# Altium schematic sheet Sensors.SchDoc
size A4; SheetNumber: 5; SheetTotal: 7
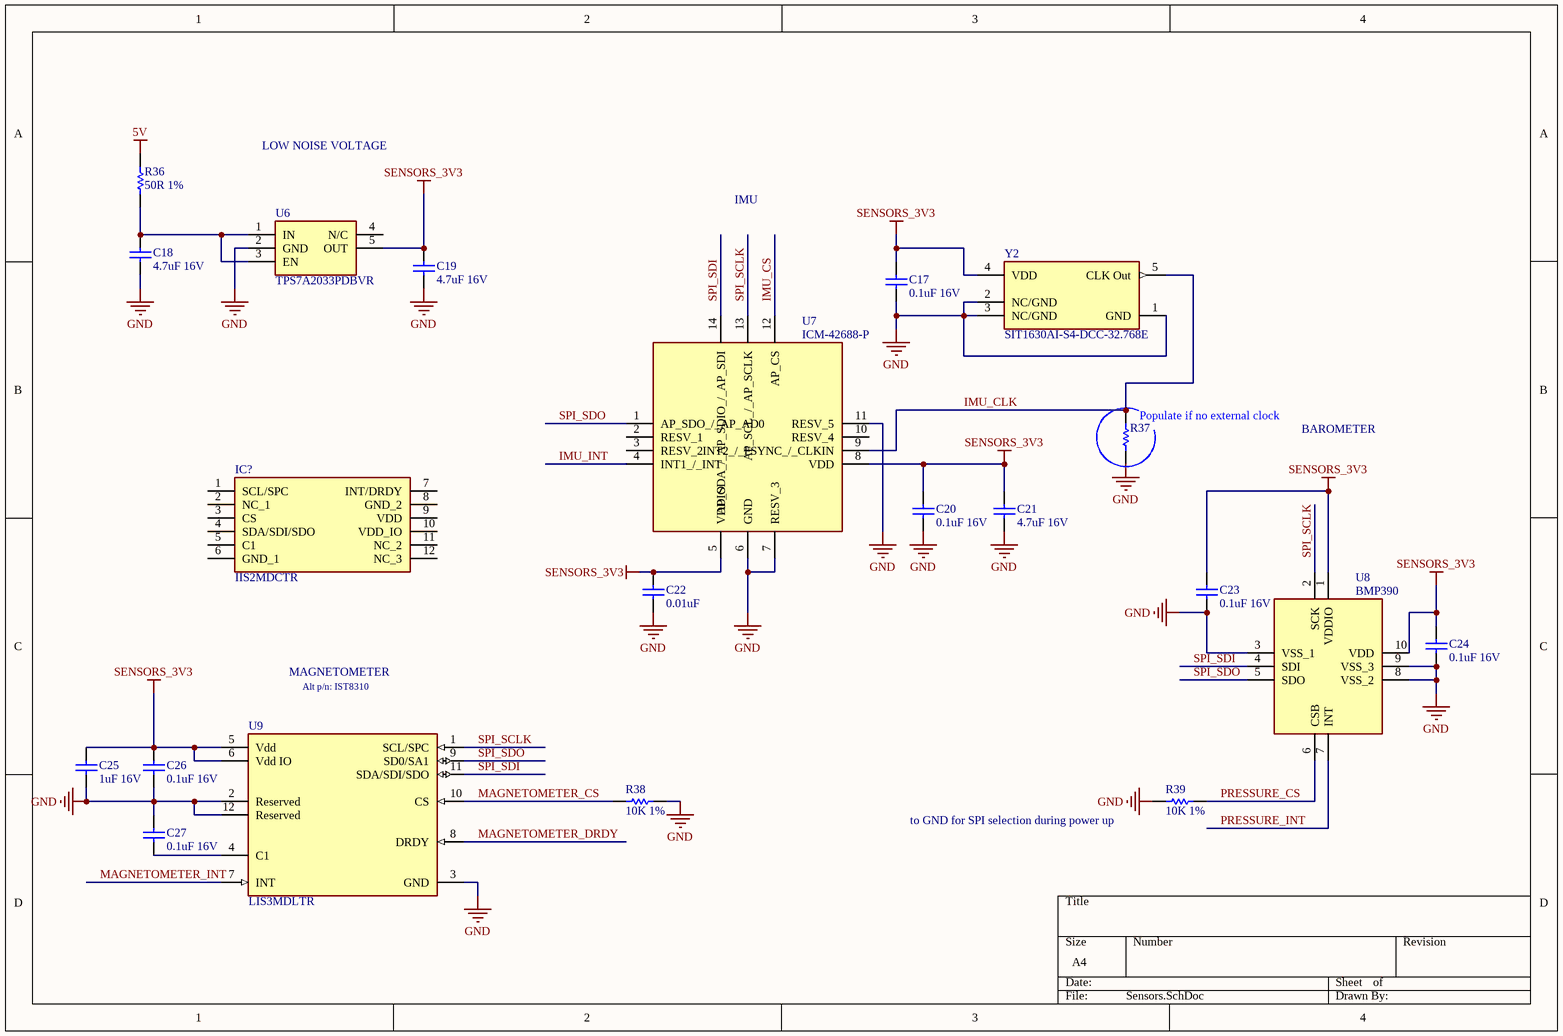
[diagram p0: Sensors.SchDoc]

## Parts
C17  0.1uF 16V  [0402]
C18  4.7uF 16V  [1608[0603]]
C19  4.7uF 16V  [1608[0603]]
C20  0.1uF 16V  [0402]
C21  4.7uF 16V  [1608[0603]]
C22  0.01uF  [0402]
C23  0.1uF 16V  [0402]
C24  0.1uF 16V  [0402]
C25  1uF 16V  [0402]
C26  0.1uF 16V  [0402]
C27  0.1uF 16V  [0402]
IC?  IIS2MDCTR  [IIS2MDCTR]
R36  50R 1%  [1608[0603]H05]
R37  0R  [0402]  (value not drawn)
R38  10K 1%  [0402]
R39  10K 1%  [0402]
U6  TPS7A2033PDBVR  [SOT95P280X145-5N]
U7  ICM-42688-P  [IIM42352]
U8  BMP390  [BMP390]
U9  LIS3MDLTR  [FP-VFLGA-12-8365767-MFG]
Y2  SIT1630AI-S4-DCC-32.768E  [FP-SiT1630-S-IPC_A]

## Nets
5V: R36.2
GND: C17.2 C18.1 C19.1 C20.1 C21.1 C22.2 C23.1 C24.1 C25.1 C26.1 C27.2 R37.1 R38.1 R39.2 U6.2(GND) U7.6(GND) U7.7(RESV_3) U7.11(RESV_5) U8.3(VSS_1) U8.8(VSS_2) U8.9(VSS_3) U9.2(Reserved) U9.3(GND) U9.12(Reserved) Y2.1(GND) Y2.2(NC/GND) Y2.3(NC/GND)
SENSORS_3V3: C17.1 C19.2 C20.2 C21.2 C22.1 C23.2 C24.2 C25.2 C26.2 U6.5(OUT) U7.5(VDDIO) U7.8(VDD) U8.1(VDDIO) U8.10(VDD) U9.5(Vdd) U9.6(Vdd_IO) Y2.4(VDD)
IMU_CLK: R37.2 U7.9(INT2_/_FSYNC_/_CLKIN) Y2.5(CLK_Out)
IMU_CS: U7.12(AP_CS)
IMU_INT: U7.4(INT1_/_INT)
MAGNETOMETER_CS: R38.2 U9.10(CS)
MAGNETOMETER_DRDY: U9.8(DRDY)
MAGNETOMETER_INT: U9.7(INT)
PRESSURE_CS: R39.1 U8.6(CSB)
PRESSURE_INT: U8.7(INT)
SPI_SCLK: U7.13(AP_SCL_/_AP_SCLK) U8.2(SCK) U9.1(SCL/SPC)
SPI_SDI: U7.14(AP_SDA_/_AP_SDIO_/_AP_SDI) U8.4(SDI) U9.11(SDA/SDI/SDO)
SPI_SDO: U7.1(AP_SDO_/_AP_AD0) U8.5(SDO) U9.9(SD0/SA1)
NetC18_2: C18.2 R36.1 U6.1(IN) U6.3(EN)
NetC27_1: C27.1 U9.4(C1)

Not connected (* = marked no-connect by the designer): IC? 1(SCL/SPC) 2(NC_1) 3(CS) 4(SDA/SDI/SDO) 5(C1) 6(GND_1) 7(INT/DRDY) 8(GND_2) 9(VDD) 10(VDD_IO) 11(NC_2) 12(NC_3); U6 4(N/C); U7 2(RESV_1) 3(RESV_2) 10(RESV_4)

## Notes on the sheet
- LOW NOISE VOLTAGE
- IMU
- (near R37) Populate if no external clock
- BAROMETER
- MAGNETOMETER
- Alt p/n: IST8310
- (near R39) to GND for SPI selection during power up

## Library data of the parts
C17 C20 C23 C24 C26 C27 = Cap0.1UF_16V_X7R: 0402 0.1 uF 16V ±10% Tolerance X7R SMT Multilayer Ceramic Capacitor; Manufacturer: Murata; Manufacturer Part Number: GCM155R71C104KA55J; Value: 100nF; RoHS: Yes; Category: Ceramic Capacitors; Stock 1: 2121057; Pricing 1: 1=0,10000, 10=0,01800, 50=0,01800, 100=0,01500, 1000=0,00900, 10000=0,00700 (USD); Mounting Technology: Surface Mount; Case/Package: 0402; Case Code (Imperial): 0402; Case Code (Metric): 1005; Min Operating Temperature: -55°C; Max Operating Temperature: 125°C; Tolerance: 10%; Voltage Rating: 16V; Voltage Rating (DC): 16V; Packaging: Tape and Reel; Package Quantity: 1; Dielectric: X7R; Termination: SMD/SMT; Series: GCM; Construction: Flat; Length: 1mm; Width: 0.5mm; Height: 0.5mm; Thickness: 0.022inch; Depth: 0.5mm; Ratings: AEC-Q200; Radiation Hardening: No; Lead Free: Lead Free; RoHS Compliant: Yes; ComponentLink1URL: https://datasheet.ciiva.com/11618/product-11618848.pdf?src-supplier=Avnet; ComponentLink1Description: https://datasheet.ciiva.com/11618/product-11618848.pdf?src-supplier=Avnet; ComponentLink2URL: https://datasheet.ciiva.com/16440/gcm155r71c104ka55j-16440393.pdf?src-supplier=Future+Electronics; ComponentLink2Description: https://datasheet.ciiva.com/16440/gcm155r71c104ka55j-16440393.pdf?src-supplier=Future+Electronics; ComponentLink3URL: https://datasheet.ciiva.com/29542/product-29542474.pdf?src-supplier=Digi-Key; ComponentLink3Description: https://datasheet.ciiva.com/29542/product-29542474.pdf?src-supplier=Digi-Key; ComponentLink4URL: https://datasheet.ciiva.com/29542/product-29542475.pdf?src-supplier=Digi-Key; ComponentLink4Description: https://datasheet.ciiva.com/29542/product-29542475.pdf?src-supplier=Digi-Key; Supplier 1: Mouser; Supplier 2: Digi-Key; Supplier Part Number 1: 81-GCM155R71C104KA5J; Supplier Part Number 2: 490-7998-1-ND
C18 C19 C21 = Cap4.7UF_16_0603: Ceramic Capacitor (Surface Mount); Manufacturer: Samsung Electro-Mechanics America, Inc.; Manufacturer Part Number: CL10A475KO8NNNC; Capacitance: 4.7µF; Tolerance: ±10%; Temperature Coefficient: X5R; Supplier 1: Digi-Key; RoHS: RoHS Compliant; Category: Capacitors; Stock 1: 166451; Pricing 1: 1=0.26, 10=0.216, 25=0.1484, 50=0.1216, 100=0.108, 500=0.07156, 1000=0.06345 (USD); Packaging: Cut Tape (CT); Voltage - Rated: 16V; Mounting Type: Surface Mount, MLCC; Operating Temperature: -55°C ~ 85°C; Applications: General Purpose; Ratings: -; Package / Case: 0603 (1608 Metric); Size / Dimension: 0.063" L x 0.031" W (1.60mm x 0.80mm); Height - Seated (Max): -; Thickness (Max): 0.035" (0.90mm); Lead Spacing: -; Features: -; Lead Style: -; ComponentLink1URL: http://www.samsungsem.com/kr/support/product-search/mlcc/CL10A475KO8NNNC.jsp; ComponentLink1Description: http://www.samsungsem.com/kr/support/product-search/mlcc/CL10A475KO8NNNC.jsp; Supplier Part Number 1: 1276-1784-1-ND
C22 = Cap0.01UF_25V: Ceramic Capacitor (Surface Mount); ComponentLink1URL: http://product.tdk.com/en/catalog/datasheets/mlcc_commercial_general_en.pdf; ComponentLink1Description: http://product.tdk.com/en/catalog/datasheets/mlcc_commercial_general_en.pdf; Supplier 1: Mouser; Supplier Part Number 1: 81-GCM155R71H103KA5J
C25 = Cap1UF_16V: Ceramic Capacitor (Surface Mount); Manufacturer: Taiyo Yuden; Manufacturer Part Number: EMK105BJ105KV-F; Capacitance: 1µF; Tolerance: ±10%; Temperature Coefficient: X5R; Supplier 1: Digi-Key; RoHS: RoHS Compliant; Category: Capacitors; Stock 1: 107475; Pricing 1: 1=0.1, 10=0.06, 50=0.0326, 100=0.0275, 250=0.02252, 500=0.01926, 1000=0.015, 5000=0.0125 (USD); Packaging: Cut Tape (CT); Voltage - Rated: 16V; Mounting Type: Surface Mount, MLCC; Operating Temperature: -55°C ~ 85°C; Applications: General Purpose; Ratings: -; Package / Case: 0402 (1005 Metric); Size / Dimension: 0.039" L x 0.020" W (1.00mm x 0.50mm); Height - Seated (Max): -; Thickness (Max): 0.022" (0.55mm); Lead Spacing: -; Features: -; Lead Style: -; ComponentLink1URL: http://ds.yuden.co.jp/TYCOMPAS/ut/detail.do?productNo=EMK105BJ105KV-F&fileName=EMK105BJ105KV-F_SS&mode=specSheetDownload; ComponentLink1Description: http://ds.yuden.co.jp/TYCOMPAS/ut/detail.do?productNo=EMK105BJ105KV-F&fileName=EMK105BJ105KV-F_SS&mode=specSheetDownload; Supplier Part Number 1: 587-2477-1-ND
IC? = IIS2MDCTR: Integrated Circuit; Manufacturer_Name: STMicroelectronics; Datasheet Link: https://www.st.com/resource/en/datasheet/iis2mdc.pdf; Height: 0.7mm; Manufacturer_Part_Number: IIS2MDCTR; Mouser Part Number: 511-IIS2MDCTR; Mouser Price/Stock: https://www.mouser.co.uk/ProductDetail/STMicroelectronics/IIS2MDCTR?qs=1mbolxNpo8ems1K%2FRdQzXg%3D%3D; Arrow Part Number: IIS2MDCTR; Arrow Price/Stock: https://www.arrow.com/en/products/iis2mdctr/stmicroelectronics?utm_currency=USD&region=europe
R36 = Res_50R_0603: Resistor,50R,0603,1%; Category: Resistors; Tolerance: ±1%; Supplier 1: Farnell; Supplier Part Number 1: 2112878
R37 = Res_0R_0402: Zero ohm Jumper 0402; Manufacturer: Yageo; Manufacturer Part Number: RC0402JR-070RL; Resistance (Ohms): 0.0; Power (Watts): 0.063W, 1/16W; Value: 0R; Supplier 1: Digi-Key; RoHS: RoHS Compliant; Category: Resistors; Stock 1: 12447313; Pricing 1: 1=0.1, 10=0.013, 25=0.0092, 100=0.0053, 250=0.004, 500=0.0032, 1000=0.00236, 2500=0.00205, 5000=0.00169 (USD); Packaging: Cut Tape (CT); Tolerance: Jumper; Composition: Thick Film; Features: Moisture Resistant; Temperature Coefficient: -; Operating Temperature: -55°C ~ 155°C; Package / Case: 0402 (1005 Metric); Supplier Device Package: 0402; Size / Dimension: 0.039" L x 0.020" W (1.00mm x 0.50mm); Height: 0.016" (0.40mm); Number of Terminations: 2; ComponentLink1URL: http://www.yageo.com/documents/recent/PYu-RC_Group_51_RoHS_L_2.pdf; ComponentLink1Description: http://www.yageo.com/documents/recent/PYu-RC_Group_51_RoHS_L_2.pdf; Supplier Part Number 1: 311-0.0JRCT-ND; MountType: SMT
R38 R39 = Res_10K_0402: Resistor; Manufacturer: Yageo; Manufacturer Part Number: RC0402FR-0710KL; Power (Watts): 0.063W, 1/16W; Temperature Coefficient: ±100ppm/°C; Supplier 1: Digi-Key; RoHS: RoHS Compliant; Category: Resistors; Stock 1: 2634839; Pricing 1: 1=0.1, 10=0.013, 25=0.0096, 100=0.0054, 250=0.00412, 500=0.00328, 1000=0.00242, 2500=0.0021, 5000=0.00173 (USD); Packaging: Cut Tape (CT); Resistance (Ohms): 10k; Tolerance: ±1%; Composition: Thick Film; Features: Moisture Resistant; Operating Temperature: -55°C ~ 155°C; Package / Case: 0402 (1005 Metric); Supplier Device Package: 0402; Size / Dimension: 0.039" L x 0.020" W (1.00mm x 0.50mm); Height: 0.016" (0.40mm); Number of Terminations: 2; ComponentLink1URL: http://www.yageo.com/NewPortal/yageodocoutput?fileName=/pdf/R-Chip/PYu-RC_Group_51_RoHS_L_3.pdf; ComponentLink1Description: http://www.yageo.com/NewPortal/yageodocoutput?fileName=/pdf/R-Chip/PYu-RC_Group_51_RoHS_L_3.pdf; Supplier Part Number 1: 311-10.0KLRCT-ND; MountType: SMT
U6 = TPS7A2033PDBVR: Integrated Circuit; Manufacturer_Name: Texas Instruments; Datasheet Link: https://www.ti.com/lit/ds/symlink/tps7a20.pdf?ts=1603960048570&ref_url=https%253A%252F%252Fwww.ti.com%252Fstore%252Fti%252Fen%252Fp%252Fproduct%252F%253Fp%253DPTPS7A2045PDQNR%2526keyMatch%253DPTPS7A2045PDQNR%2526tisearch%253DSearch-EN-everything; Height: 1.45mm; Manufacturer_Part_Number: TPS7A2033PDBVR; Mouser Part Number: 595-TPS7A2033PDBVR; Mouser Price/Stock: https://www.mouser.co.uk/ProductDetail/Texas-Instruments/TPS7A2033PDBVR?qs=hd1VzrDQEGjk%2FOBnRfKB4A%3D%3D; Arrow Part Number: TPS7A2033PDBVR; Arrow Price/Stock: null?region=nac
U7 = ICM-42688-P: Accelerometer and Gyroscope 6-Axis MEMS Motion Tracking Device Digital-OUT 14-Pin LGA T/R; Manufacturer_Name: TDK; Manufacturer: TDK InvenSense; Max Supply Voltage: 3.6V; Min Supply Voltage: 1.71V; Datasheet Link: https://3cfeqx1hf82y3xcoull08ihx-wpengine.netdna-ssl.com/wp-content/uploads/2021/06/DS-000347-ICM-42688-P-v1.5.pdf; Manufacturer_Part_Number: ICM-42688-P; Mouser Part Number: 410-ICM-42688-P; Mouser Price/Stock: https://www.mouser.co.uk/ProductDetail/TDK-InvenSense/ICM-42688-P?qs=OlC7AqGiEDk8QrNAV728zw%3D%3D; Arrow Part Number: ICM-42688-P; Arrow Price/Stock: https://www.arrow.com/en/products/icm-42688-p/invensense?region=nac; Supplier: Digikey; Supplier Part Number: 1428-ICM-42688-PCT-ND; Manufacturer Part Number: ICM-42688-P; RoHS: No; Category: Linear ICs; Stock: 15557; Pricing: 1=6.99, 10=5.595, 25=5.1756, 100=4.4763, 500=4.19656, 1000=3.91678 (USD); Min Operating Temperature: -40°C; Max Operating Temperature: 85°C; Length: 2.5mm; Width: 3mm; Height: 970um; ComponentLink1URL: https://media.digikey.com/pdf/Data%20Sheets/TDK%20PDFs/ICM-42688-P_DS_Rev1.2.pdf?src-supplier=Digikey; ComponentLink1Description: https://media.digikey.com/pdf/Data%20Sheets/TDK%20PDFs/ICM-42688-P_DS_Rev1.2.pdf?src-supplier=Digikey; Supplier 1: Digikey; Supplier Part Number 1: 1428-ICM-42688-PCT-ND
U8 = BMP390: Pressure sensor, 300-1250hPa, 2.0*2.0*0.75mm, I2C/SPI; Manufacturer_Name: BOSCH; Manufacturer: Bosch Sensortec; Datasheet Link: https://www.bosch-sensortec.com/media/boschsensortec/downloads/datasheets/bst-bmp390-ds002.pdf; Height: 0.8mm; Manufacturer_Part_Number: BMP390; Mouser Part Number: 262-BMP390; Mouser Price/Stock: https://www.mouser.co.uk/ProductDetail/Bosch-Sensortec/BMP390?qs=QNEnbhJQKvYQVfvRMgo2YA%3D%3D; Arrow Part Number: BMP390; Arrow Price/Stock: https://www.arrow.com/en/products/bmp390/bosch?region=nac; Supplier: Future Electronics; Supplier Part Number: 3151950; Manufacturer Part Number: BMP390; RoHS: No; Category: Uncategorized; Stock: 210; Pricing: 1=3.08, 20=2.82, 150=2.64, 1000=2.48, 5000=2.34 (USD); Supplier 1: Mouser; Supplier Part Number 1: 262-BMP390
U9 = LIS3MDLTR: SENSOR MR I2C/SPI 12LGA; Manufacturer: STMicroelectronics; Sensor Output: I2C,SPI; Operating Supply Current: 40-270uA; Max Supply Voltage: 3.6V; Sensing Method: Magnetic; Min Supply Voltage: 1.71V; ComponentLink2URL: https://www.st.com/resource/en/datasheet/lis3mdl.pdf; Category: IC; Manufacturer Part Number: LIS3MDLTR; Octopart: https://octopart.com/lis3mdltr-stmicroelectronics-29403125; Automotive: No; ComponentLink2Description: Datasheet; RoHS: TRUE; Device Class L3: unset; Device Class L1: Sensors; Temperature: -40°C to +85°C; Height: 1mm; Mouser Description: Board Mount Hall Effect / Magnetic Sensors Ultra Lo-Pwr Hi Perf 3-Axis 1.9-3.6V; Temperature Range High: +85°C; Lead Free: Yes; Device Class L2: Magnetic Sensors; Footprint Url: https://www.st.com/content/ccc/resource/technical/document/technical_note/73/17/9c/16/dd/96/4a/01/CD00134799.pdf/files/CD00134799.pdf/jcr:content/translations/en.CD00134799.pdf; Temperature Range Low: -40°C; Package: VFLGA-12-8365767; Digikey Description: SENSOR MR I2C/SPI 12LGA; Supplier 1: Mouser; Supplier Part Number 1: 511-LIS3MDLTR
Y2 = CMP-25159-260193-1: MEMS OSC XO 32.7680KHZ LVCMOS; RoHS Compliant: Yes